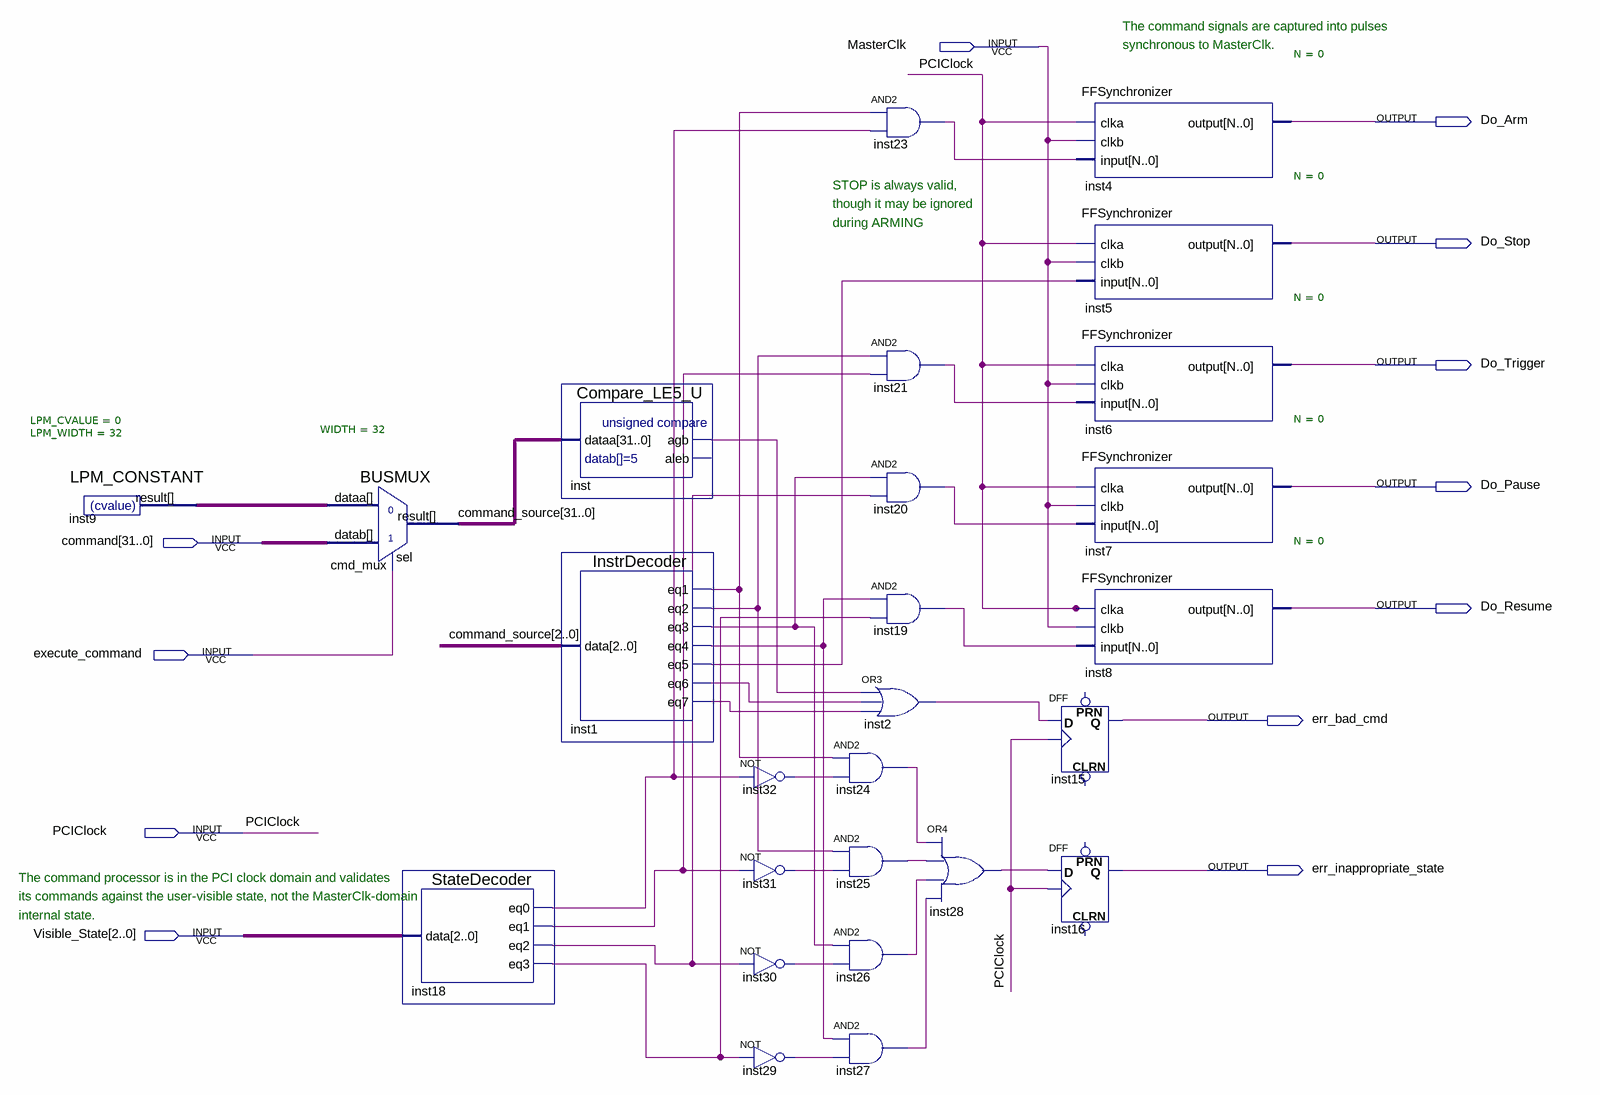
[diagram p0: schematic sheet]
// Quartus schematic CommandDecoder.bdf as structural Verilog: 26 symbols, 12 pins
module CommandDecoder (
  input  MasterClk,
  input  [31:0] command,
  input  execute_command,
  input  PCIClock,
  input  [2:0] Visible_State,
  output Do_Arm,
  output Do_Stop,
  output Do_Trigger,
  output Do_Pause,
  output Do_Resume,
  output err_bad_cmd,
  output err_inappropriate_state
);

  wire inst1_eq1, inst1_eq2, inst1_eq3, inst1_eq4, inst1_eq5, inst1_eq6, inst1_eq7, inst2_out, inst18_eq0,
       inst18_eq1, inst18_eq2, inst18_eq3, inst19_out, inst20_out, inst21_out, inst23_out, inst24_out,
       inst25_out, inst26_out, inst27_out, inst28_out, inst29_out, inst30_out, inst31_out, inst32_out,
       inst_agb;
  wire [31:0] command_source, inst9_result;

  LPM_CONSTANT #(.LPM_CVALUE(0), .LPM_WIDTH(32)) inst9 (.result(inst9_result));
  BUSMUX #(.WIDTH(32)) cmd_mux (.datab(command), .sel(execute_command), .dataa(inst9_result), .result(command_source));
  StateDecoder inst18 (.data(Visible_State), .eq0(inst18_eq0), .eq1(inst18_eq1), .eq2(inst18_eq2), .eq3(inst18_eq3));
  Compare_LE5_U inst (.dataa(command_source), .agb(inst_agb));  // open: aleb
  InstrDecoder inst1 (
    .data(command_source[2:0]), .eq1(inst1_eq1), .eq2(inst1_eq2), .eq3(inst1_eq3), .eq4(inst1_eq4),
    .eq5(inst1_eq5), .eq6(inst1_eq6), .eq7(inst1_eq7));
  not inst32 (inst32_out, inst18_eq0);
  not inst31 (inst31_out, inst18_eq1);
  not inst30 (inst30_out, inst18_eq2);
  not inst29 (inst29_out, inst18_eq3);
  and inst23 (inst23_out, inst1_eq1, inst18_eq0);
  and inst21 (inst21_out, inst1_eq2, inst18_eq1);
  and inst20 (inst20_out, inst1_eq3, inst18_eq2);
  and inst19 (inst19_out, inst1_eq4, inst18_eq3);
  or inst2 (inst2_out, inst_agb, inst1_eq6, inst1_eq7);
  and inst24 (inst24_out, inst1_eq1, inst32_out);
  and inst25 (inst25_out, inst1_eq2, inst31_out);
  and inst26 (inst26_out, inst1_eq3, inst30_out);
  and inst27 (inst27_out, inst1_eq4, inst29_out);
  or inst28 (inst28_out, inst24_out, inst25_out, inst26_out, inst27_out);
  FFSynchronizer #(.N(0)) inst4 (.clka(PCIClock), .clkb(MasterClk), .\input (inst23_out), .\output (Do_Arm));
  FFSynchronizer #(.N(0)) inst5 (.clka(PCIClock), .clkb(MasterClk), .\input (inst1_eq5), .\output (Do_Stop));
  FFSynchronizer #(.N(0)) inst6 (.clka(PCIClock), .clkb(MasterClk), .\input (inst21_out), .\output (Do_Trigger));
  FFSynchronizer #(.N(0)) inst7 (.clka(PCIClock), .clkb(MasterClk), .\input (inst20_out), .\output (Do_Pause));
  FFSynchronizer #(.N(0)) inst8 (.clka(PCIClock), .clkb(MasterClk), .\input (inst19_out), .\output (Do_Resume));
  DFF inst15 (.CLK(PCIClock), .D(inst2_out), .Q(err_bad_cmd));  // open: CLRN, PRN
  DFF inst16 (.CLK(PCIClock), .D(inst28_out), .Q(err_inappropriate_state));  // open: CLRN, PRN

  // Notes on the sheet:
  //   The command signals are captured into pulses
  //   synchronous to MasterClk.
  //   STOP is always valid,
  //   though it may be ignored
  //   during ARMING
  //   The command processor is in the PCI clock domain and validates
  //   its commands against the user-visible state, not the MasterClk-domain
  //   internal state.
endmodule
